# EAGLE design EnsembleThree (EAGLE 7.6.0)
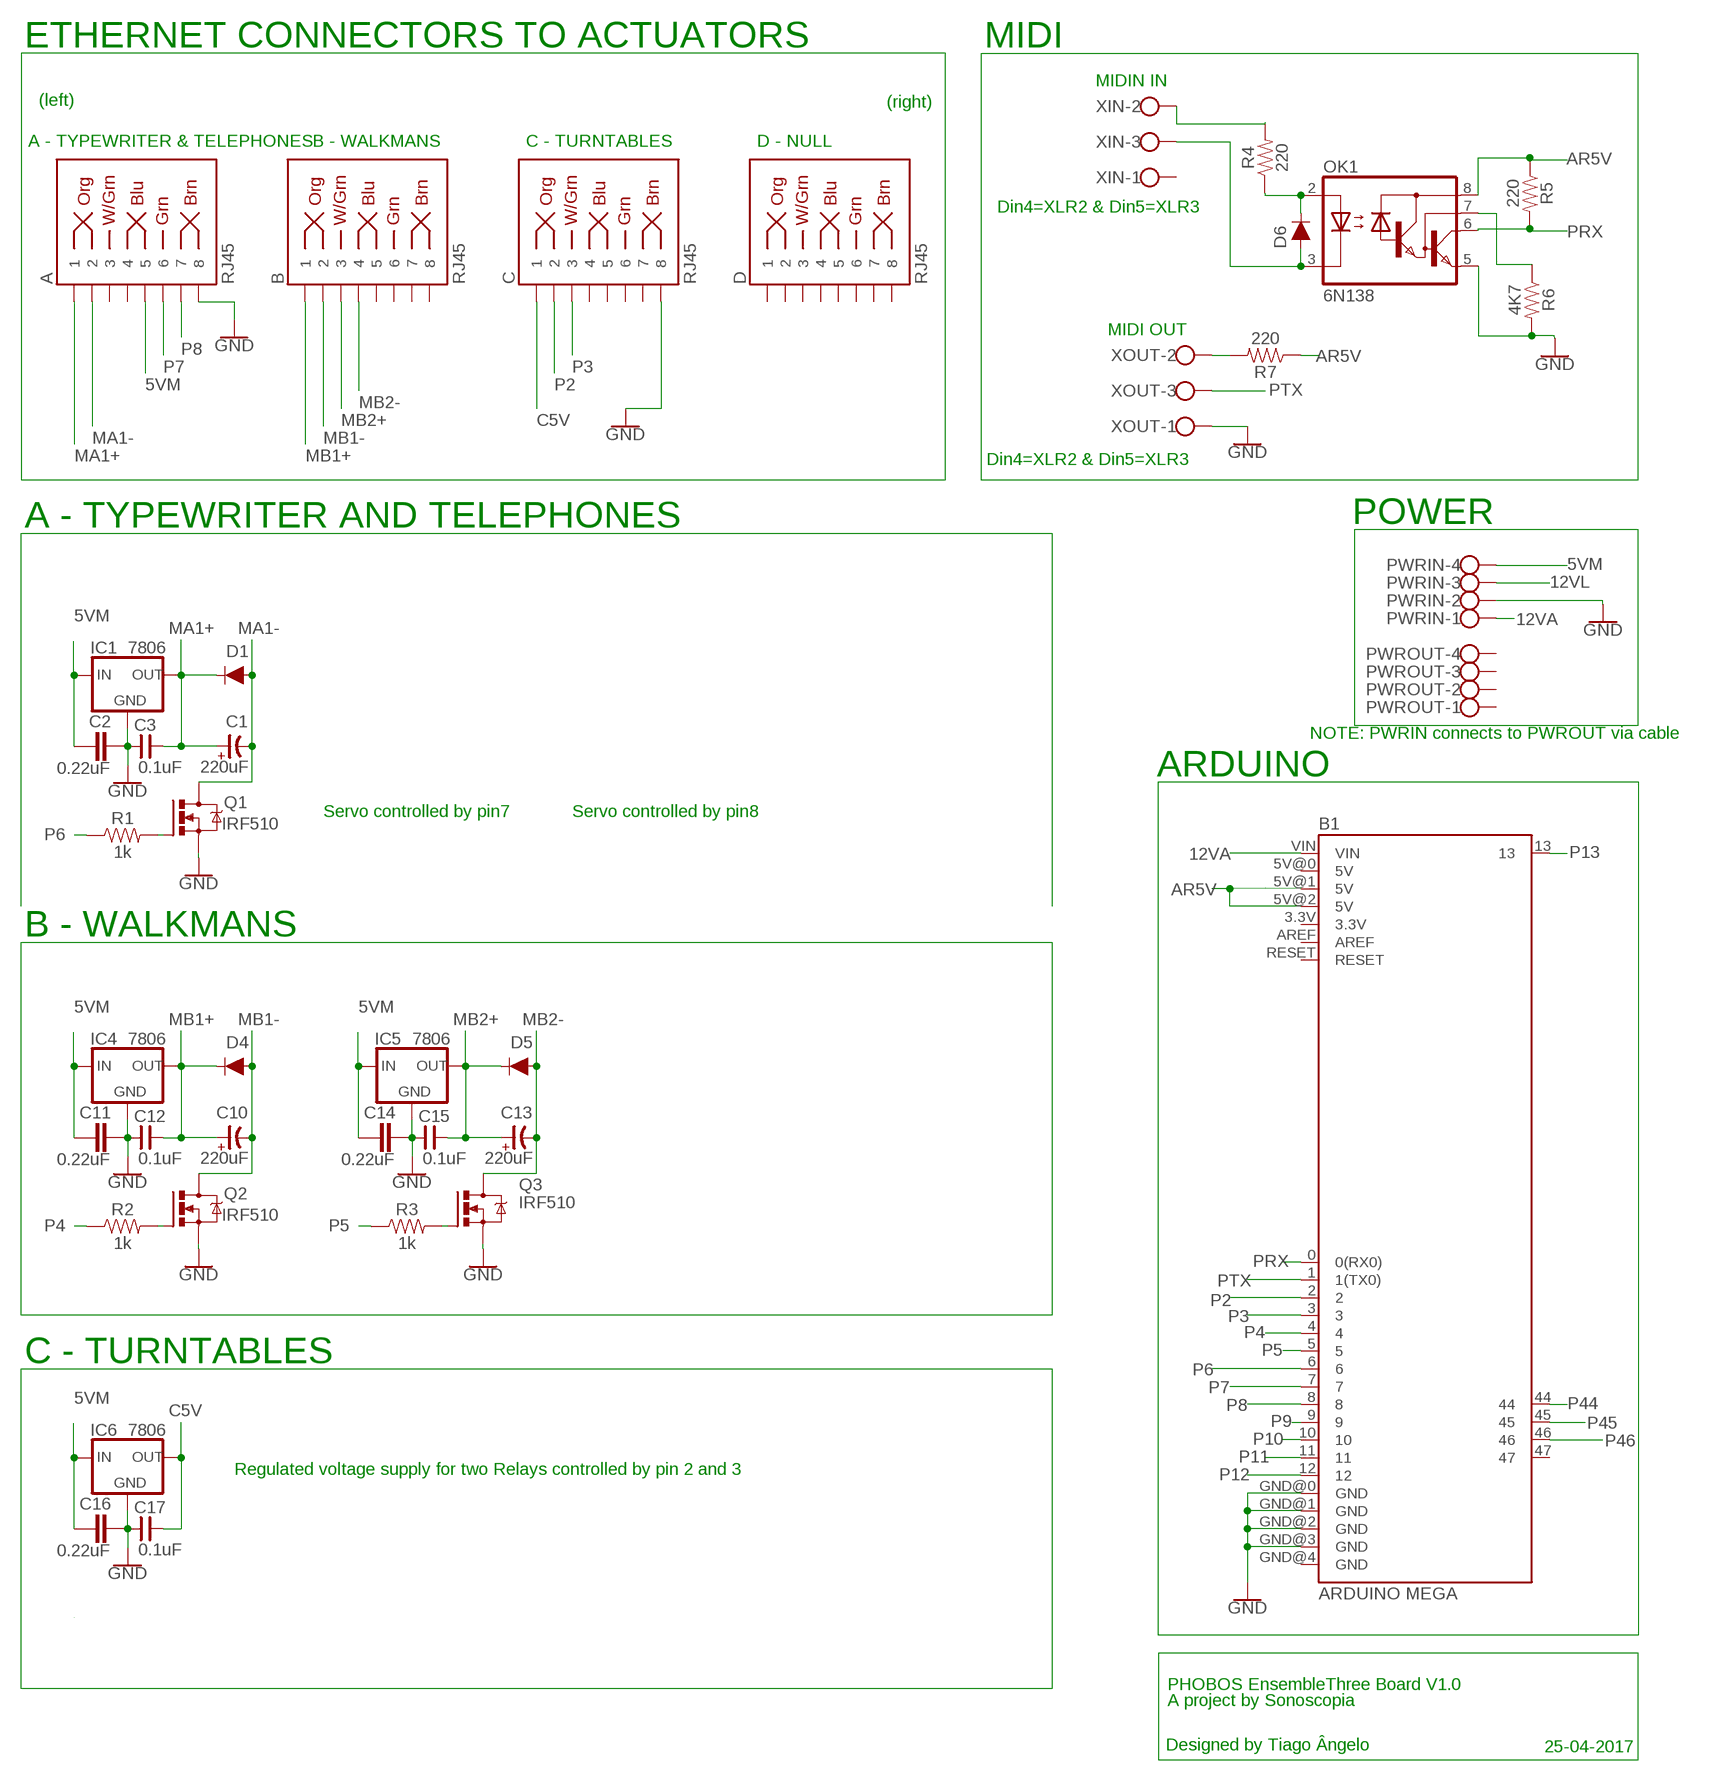
[diagram p0: schematic, sheet 1]

## Parts
A  RJ45  RJ45-8  [RJ45-8]
B  RJ45  RJ45-8  [RJ45-8]
B1  ARDUINO MEGA  ARDUINO_MEGA_R3FULL  [ARDUINO_MEGA]
C  RJ45  RJ45-8  [RJ45-8]
C1  220uF  CP-E-035X080  [E-035X080]
C2  0.22uF  C5/3  [C5B3]
C3  0.1uF  CNP-C025-050X025  [C025-050X025]
C10  220uF  CP-E-035X080  [E-035X080]
C11  0.22uF  C5/3  [C5B3]
C12  0.1uF  CNP-C025-050X025  [C025-050X025]
C13  220uF  CAP-MASTER_CP-E-035X080  [CAP-MASTER_E-035X080]
C14  0.22uF  C5/3  [C5B3]
C15  0.1uF  CNP-C025-050X025  [C025-050X025]
C16  0.22uF  C5/3  [C5B3]
C17  0.1uF  CNP-C025-050X025  [C025-050X025]
D  RJ45  RJ45-8  [RJ45-8]
D1  1A/50V/1.1V  DIODE-KIT2  [DIODE-1N4001-KIT]
D4  1A/50V/1.1V  DIODE-KIT2  [DIODE-1N4001-KIT]
D5  1A/50V/1.1V  DIODE-KIT2  [DIODE-1N4001-KIT]
D6  200mA/100V/1V  DIODE-1N4148  [DIODE-1N4148]
IC1  7806  78XXS  [78XXS]
IC4  7806  78XXS  [78XXS]
IC5  7806  78XXS  [78XXS]
IC6  7806  78XXS  [78XXS]
OK1  6N138  [DIL08]
PWRIN  W237-4  [W237-4]
PWROUT  W237-4  [W237-4]
Q1  IRF510  IRF520  [TO220BV]
Q2  IRF510  IRF520  [TO220BV]
Q3  IRF510  TRANSISTOR-POWER_IRF520  [TRANSISTOR-POWER_TO220BV]
R1  1k  1KOHM-VERT-1/4W-1%  [AXIAL-0.1]
R2  1k  1KOHM-VERT-1/4W-1%  [AXIAL-0.1]
R3  1k  1KOHM-VERT-1/4W-1%  [AXIAL-0.1]
R4  220  1KOHM-HORIZ-1/4W-5%  [AXIAL-0.3]
R5  220  1KOHM-HORIZ-1/4W-5%  [AXIAL-0.3]
R6  4K7  1KOHM-HORIZ-1/4W-5%  [AXIAL-0.3]
R7  220  1KOHM-HORIZ-1/4W-5%  [AXIAL-0.3]
XIN  W237-103  [W237-103]
XOUT  W237-103  [W237-103]

## Nets
5VM [5VM]: A.5 C2.1 C11.1 C14.1 C16.1 IC1.IN IC4.IN IC5.IN IC6.IN PWRIN.4
12VA [12VA]: B1.VIN PWRIN.1
12VL [12VL]: PWRIN.3
AR5V: B1.5V@1(5V) B1.5V@2(5V) OK1.8(VCC) R5.P$1 R7.P$1
C5V: C17.2 C.1 IC6.OUT
GND [GND]: A.8 B1.GND@0(GND) B1.GND@1(GND) B1.GND@2(GND) B1.GND@3(GND) C2.2 C3.1 C11.2 C12.1 C14.2 C15.1 C16.2 C17.1 C.8 IC1.GND IC4.GND IC5.GND IC6.GND OK1.5(GND) PWRIN.2 Q1.S Q2.S Q3.S R6.P$2 XOUT.1
MA1+: A.1 C1.+ C3.2 D1.C IC1.OUT
MA1-: A.2 C1.- D1.A Q1.D
MB1+: B.1 C10.+ C12.2 D4.C IC4.OUT
MB1-: B.2 C10.- D4.A Q2.D
MB2+: B.3 C13.+ C15.2 D5.C IC5.OUT
MB2-: B.4 C13.- D5.A Q3.D
N$1: Q1.G R1.P$2
N$2: R7.P$2 XOUT.2
N$15: Q2.G R2.P$2
N$16: Q3.G R3.P$2
N$25: D6.A OK1.3(C) XIN.3
N$26: D6.C OK1.2(A) R4.P$1
N$27: R4.P$2 XIN.2
N$29: OK1.7(VB) R6.P$1
P2: B1.2 C.2
P3: B1.3 C.3
P4: B1.4 R2.P$1
P5: B1.5 R3.P$1
P6: B1.6 R1.P$1
P7: A.6 B1.7
P8: A.7 B1.8
P9: B1.9
P10: B1.10
P11: B1.11
P12: B1.12
P13: B1.13
P44: B1.44
P45: B1.45
P46: B1.46
PRX: B1.0(0(RX0)) OK1.6(VO) R5.P$2
PTX: B1.1(1(TX0)) XOUT.3
Unconnected: A.3 A.4 B1.3.3V B1.5V@0(5V) B1.47 B1.AREF B1.GND@4(GND) B1.RESET B.5 B.6 B.7 B.8 C.4 C.5 C.6 C.7 D.1 D.2 D.3 D.4 D.5 D.6 D.7 D.8 PWROUT.1 PWROUT.2 PWROUT.3 PWROUT.4 XIN.1

## Notes on the sheet
- ETHERNET CONNECTORS TO ACTUATORS | MIDI
- MIDIN IN
- (left) | (right)
- A - TYPEWRITER & TELEPHONES | B - WALKMANS | C - TURNTABLES | D - NULL
- Din4=XLR2 & Din5=XLR3
- MIDI OUT
- Din4=XLR2 & Din5=XLR3
- A - TYPEWRITER AND TELEPHONES | POWER
- NOTE: PWRIN connects to PWROUT via cable
- ARDUINO
- Servo controlled by pin7 | Servo controlled by pin8
- B - WALKMANS
- C - TURNTABLES
- Regulated voltage supply for two Relays controlled by pin 2 and 3
- PHOBOS EnsembleThree Board V1.0
- A project by Sonoscopia
- Designed by Tiago Ângelo | 25-04-2017

## Library data of the parts
A B C D = SparkFun-Connectors:RJ45-8: RJ45 Jack - 8 pin Simple RJ45, 8-pin connection. Commonly used for Cat5, Cat5e, and Cat6 Ethernet cables. Here is the connector we sell at SparkFun: RJ45 8-Pin Connector <https://www.sparkfun.com/products/643> (PRT-00643) Datasheet <https://cdn.sparkfun.com/datasheets/Prototyping/04908.pdf> It is used on this SparkFun product: SparkFun RJ45 Breakout <https://www.sparkfun.com/products/716> (BOB-00716) Note, you may also be interested in the "MAGJACK" version of this. It is basically a RJ45 connector, but also has some status LEDs built into the connector housing. You can check that out in this library at the device named "MAGJACK.dev" and see these products online: RJ45 Ethernet MagJack-Compatible <https://www.sparkfun.com/products/8534> (PRT-08534) SparkFun RJ45 MagJack Breakout <https://www.sparkfun.com/products/13021> (BOB-13021); PROD_ID: CONN-08506; SF_ID: PRT-00643
B1 = PHOBOS-Boards:ARDUINO_MEGA_R3: Arduino Mega R3 ATmega2560 R3 compatible footprint. SparkFun Products: Arduino Mega 2560 R3 <https://www.sparkfun.com/products/11061>
C1 C10 = cap-master:CP-: POLARIZED CAP
C2 C11 C14 C16 = capacitor-wima:C: CAPACITOR naming: grid - package width
C3 C12 C15 C17 = cap-master:CNP-: NON-POLARIZED CAP
C13 = PHOBOS-lbr:CAP-MASTER_CP-: POLARIZED CAP
D1 D4 D5 = SparkFun-DiscreteSemi:DIODE: Diode These are standard reverse protection diodes and small signal diodes. SparkFun Products: SparkFun SparkPunk Sound Kit <https://www.sparkfun.com/products/11177> SparkFun ESP8266 Thing <https://www.sparkfun.com/products/13231>; PROD_ID: DIO-09176
D6 = SparkFun-DiscreteSemi:DIODE: Diode These are standard reverse protection diodes and small signal diodes. SparkFun Products: SparkFun SparkPunk Sound Kit <https://www.sparkfun.com/products/11177> SparkFun ESP8266 Thing <https://www.sparkfun.com/products/13231>; PROD_ID: DIO-08378
IC1 IC4-IC6 = v-reg:78XXS: VOLTAGE REGULATOR
OK1 = optocoupler:6N138: MOTOROLA OPTO COUPLER; MF: VISHAY/TELEFUNKEN; MPN: 6N138; OC_FARNELL: 9860150; OC_NEWARK: 35K5294
PWRIN PWROUT = con-wago-500:W237-4: WAGO SCREW CLAMP; OC_FARNELL: unknown; OC_NEWARK: unknown
Q1 Q2 = transistor-power:IRF520: HEXFET Power MOSFET
Q3 = PHOBOS-lbr:TRANSISTOR-POWER_IRF520: HEXFET Power MOSFET
R1-R3 = SparkFun-Resistors:1KOHM: 1kΩ resistor A resistor is a passive two-terminal electrical component that implements electrical resistance as a circuit element. Resistors act to reduce current flow, and, at the same time, act to lower voltage levels within circuits. - Wikipedia; PROD_ID: RES-12182
R4-R7 = SparkFun-Resistors:1KOHM: 1kΩ resistor A resistor is a passive two-terminal electrical component that implements electrical resistance as a circuit element. Resistors act to reduce current flow, and, at the same time, act to lower voltage levels within circuits. - Wikipedia; PROD_ID: RES-08380; VALUE: 1k
XIN XOUT = con-wago-500:W237-103: WAGO SCREW CLAMP; MPN: 237-103; OC_FARNELL: unknown; OC_NEWARK: 18M7116

## Net classes
0 default: width 0.508 mm, drill 0.508 mm, clearance 0.406 mm
1 GND: width 1.016 mm, drill 0.508 mm, clearance 0.508 mm
2 5VM: width 1.016 mm, drill 0.508 mm, clearance 0.508 mm
3 12VL: width 0.61 mm, drill 0.508 mm, clearance 0.508 mm
4 12VA: width 0.508 mm, drill 0.508 mm, clearance 0.508 mm
5 AR5V: width 0.406 mm, drill 0.508 mm, clearance 0.508 mm
6 PTX: width 0.406 mm, drill 0.508 mm, clearance 0.508 mm
7 PRX: width 0.406 mm, drill 0.508 mm, clearance 0.508 mm

## Board
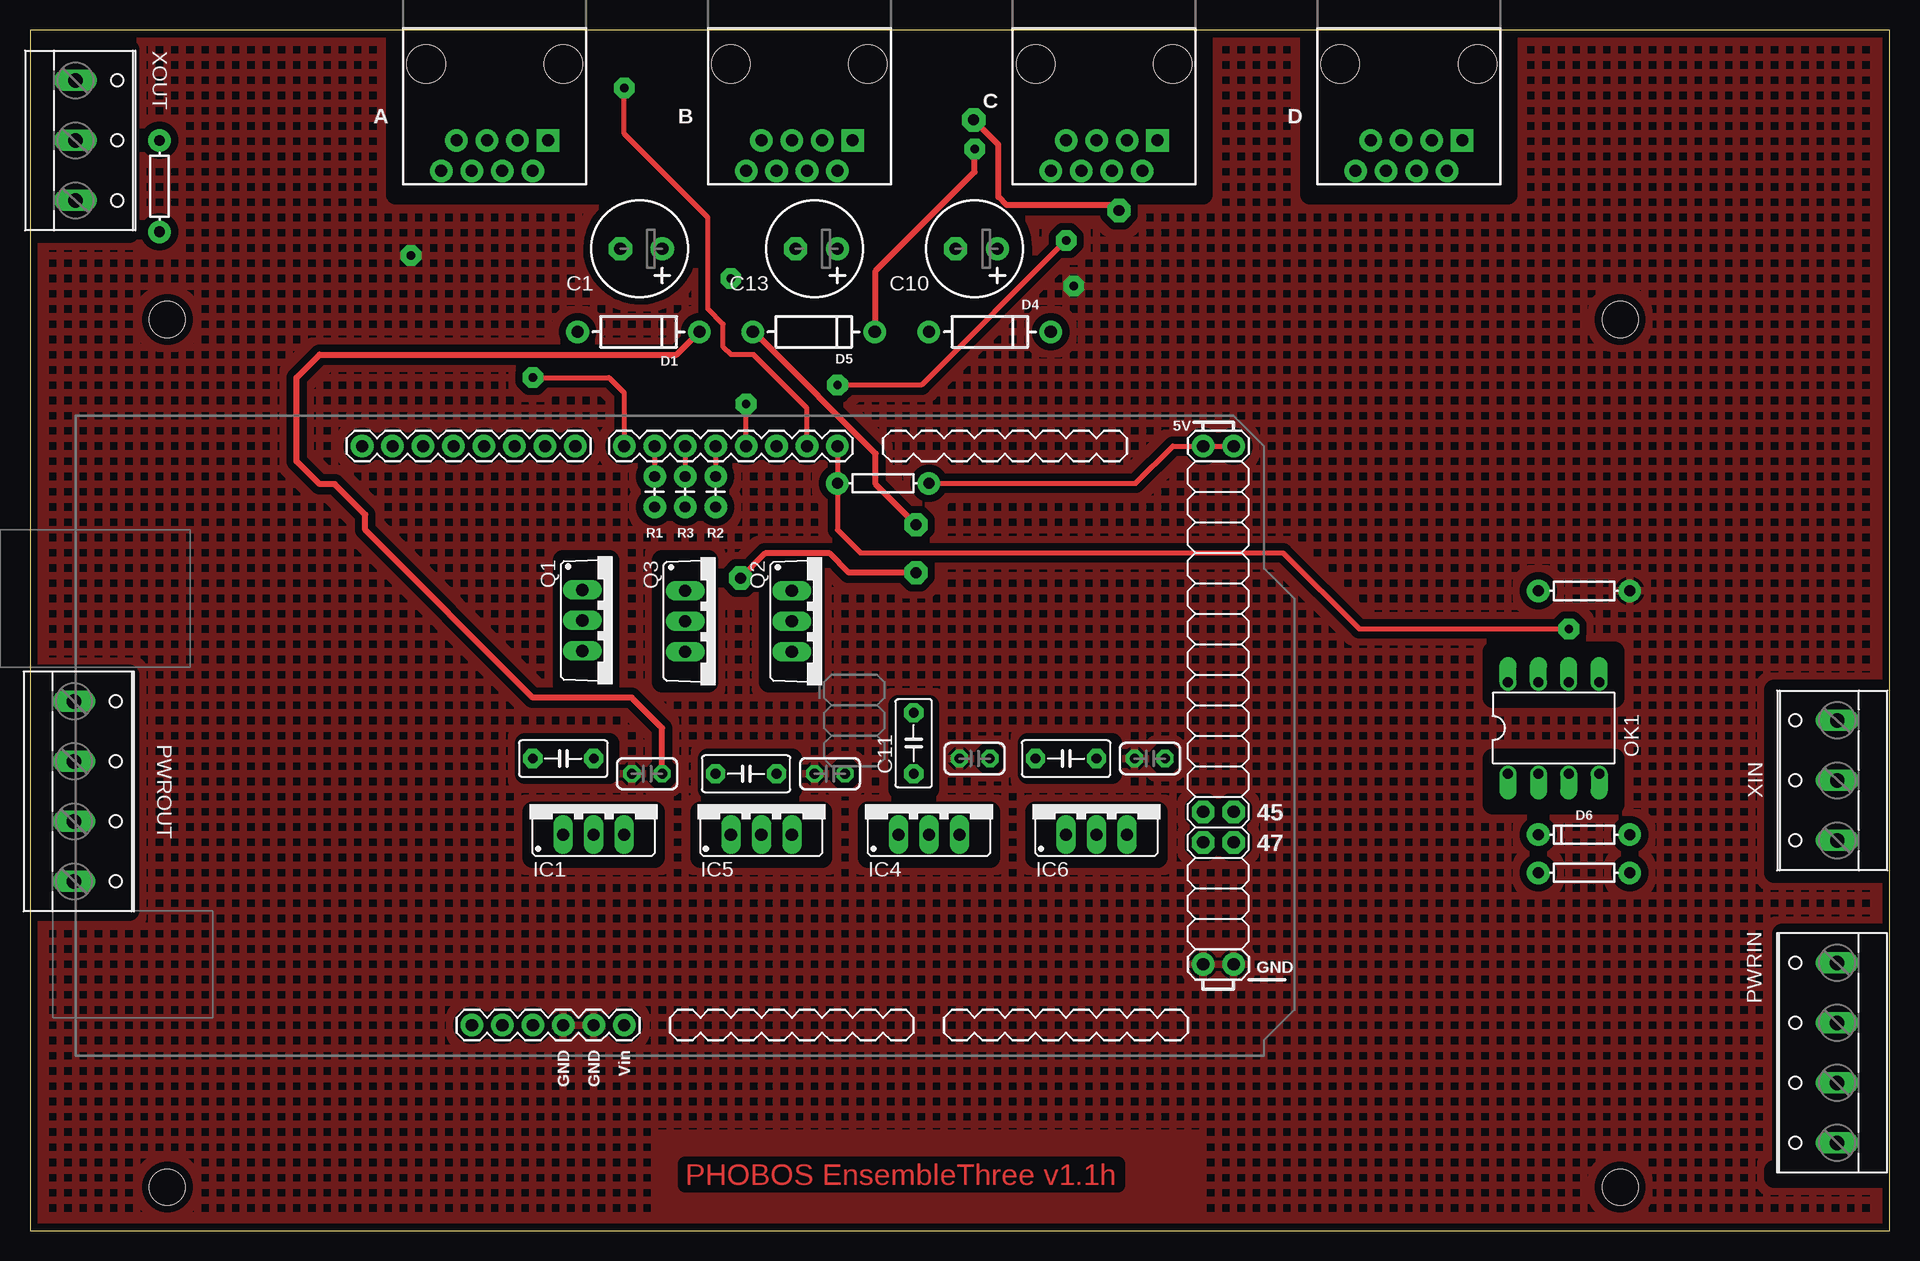
[diagram p1: board, top side]
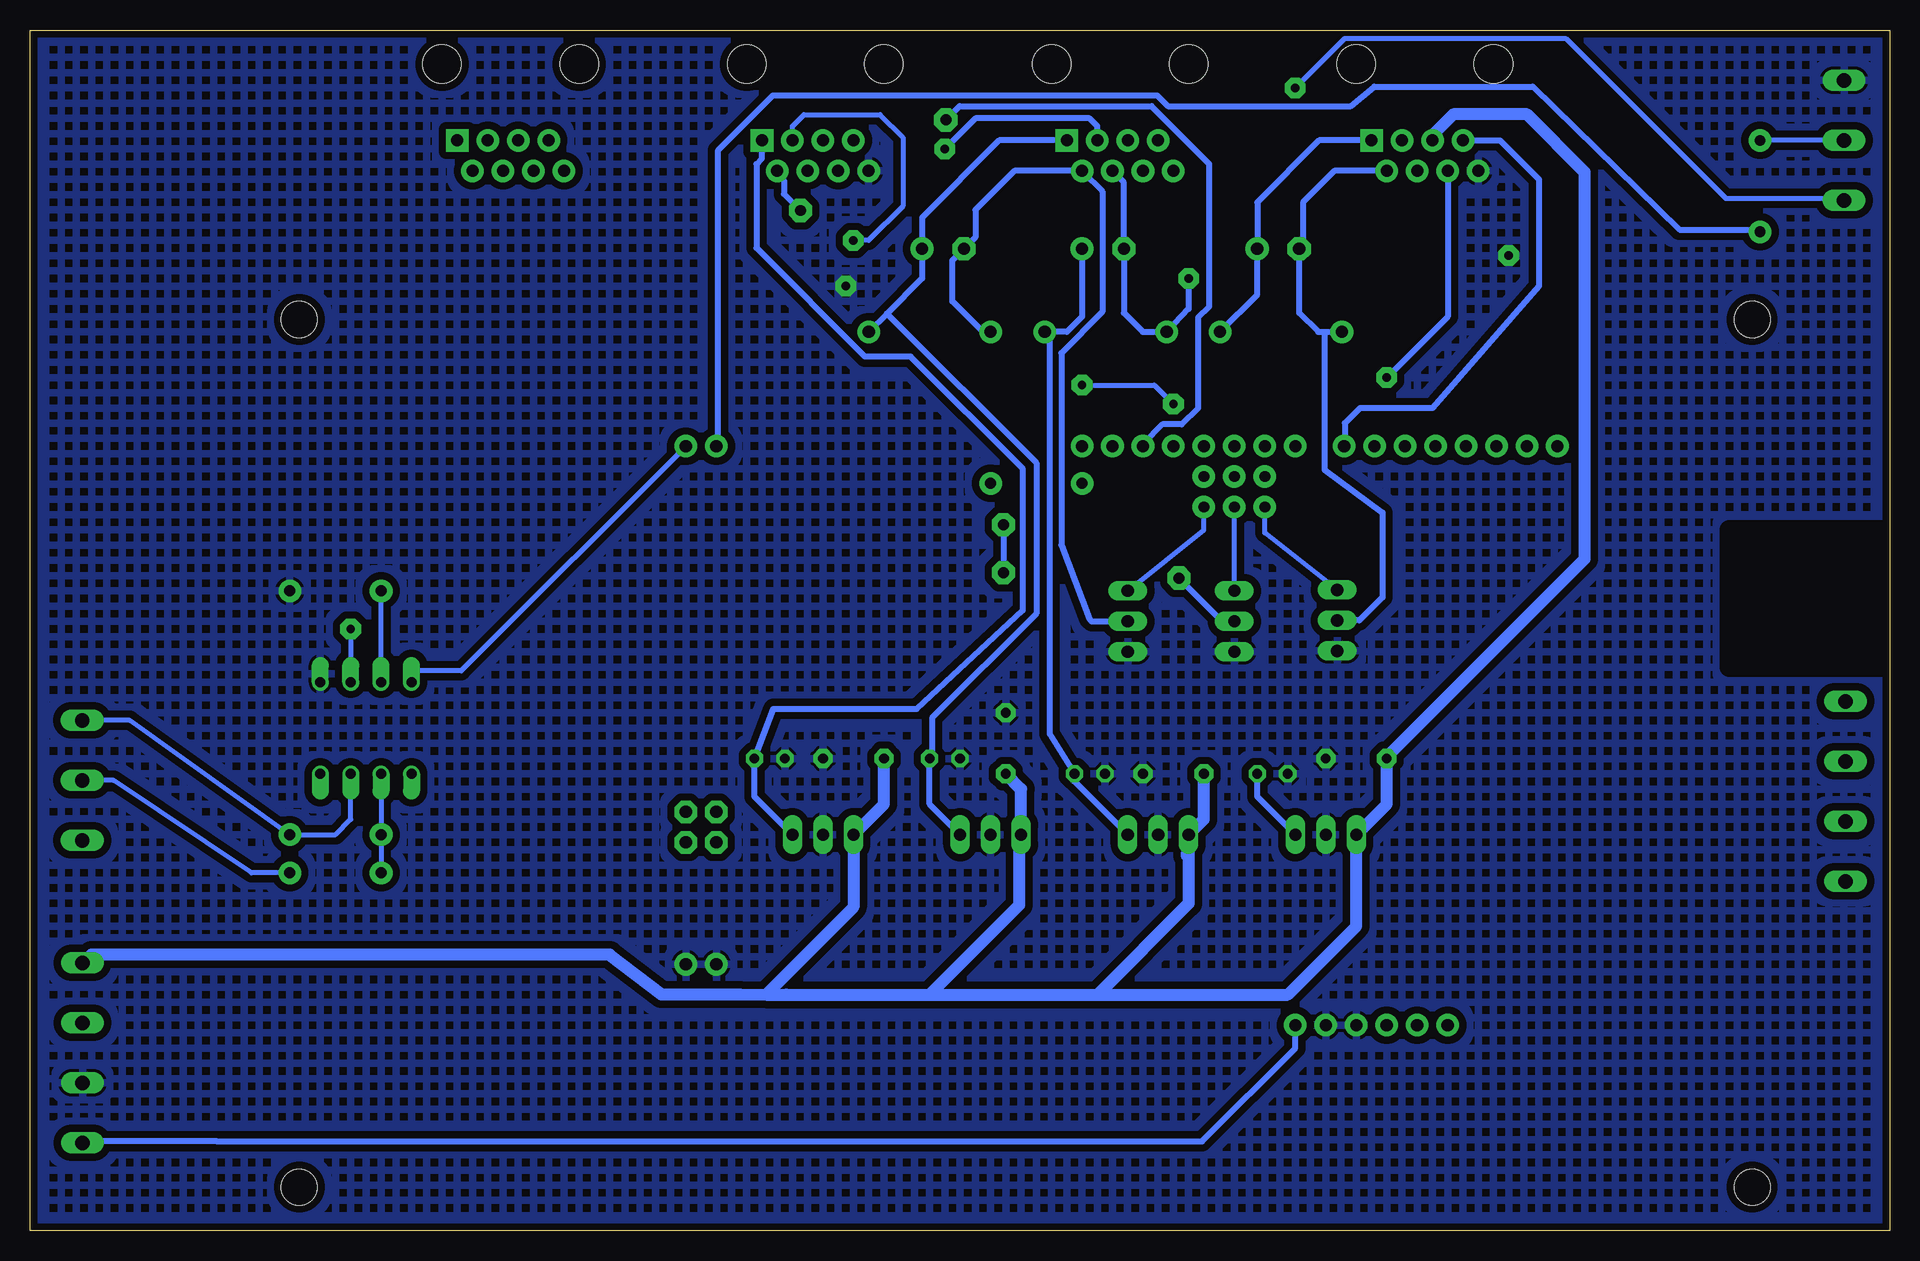
[diagram p2: board, bottom side, seen from below]

Size 155 x 100.08 mm. Coordinates in mm from the lower left corner, seen from the top.
Outline: 0,0 155,0 155,100.08 0,100.08 0,0
Copper layers (1*16): Top 0.035mm / dielectric 1.5mm / Bottom 0.035mm
Design rules "Dek": minimum track width 12mil, minimum drill 36mil, track to track 12mil, track to pad 12mil, pad to pad 12mil, via to via 12mil, smd to smd 0mil, copper to edge 10mil, drill to drill 12mil, minimum pad ring 12mil, minimum via ring 20mil, stop-mask expansion 4mil, vias tented up to drill 25mil, thermal gap 10mil
Holes 3 mm at 132.55,75.95 132.55,3.65 11.45,3.65 11.45,75.95
tRestrict: area 30.5,86.4 to 47,108; area 55.9,86.4 to 72.4,108; area 81.3,86.4 to 97.8,108; area 106.7,86.4 to 123.2,108; area -0.6,26.7 to 8.3,46.4; area 145.4,4.4 to 154.9,24.8; area 145.4,29.8 to 154.3,45.1; area -0.6,83.2 to 8.3,98.4; area 121.9,44.5 to 132.1,48.3; area 121.9,35.6 to 132.1,39.4; area 47,78 to 54.7,85.8; area 61.6,78 to 69.3,85.8; 12 more areas
bRestrict: area -2.5,47 to 13.3,58.4
vRestrict: area 71.1,64.1 to 91.4,66.7; area 96.5,36.2 to 101.6,64.1; area 96.5,23.5 to 101.6,31.1; area 53.3,15.9 to 73.7,18.4; area 76.2,15.9 to 96.5,18.4; area -2.5,47 to 13.3,58.4; area 26,64.1 to 47,66.7; area 121.9,38.7 to 132.1,44.5; area 18.4,71.8 to 24.8,74.3; area 32.4,71.8 to 38.7,74.3; area 47.6,73.7 to 54,76.2; area 62.2,73.7 to 68.6,76.2; 1 more areas

### Footprints (pad centres in the part's own frame; a part is rotated, then mirrored left to right if it is on the bottom)
RJ45-8 = drill 1 pad 1.88 square: 1 -4.445,6.35 | drill 1 pad 1.88: 2 -3.175,8.89; 3 -1.905,6.35; 4 -0.635,8.89; 5 0.635,6.35; 6 1.905,8.89; 7 3.175,6.35; 8 4.445,8.89 | hole 3.2: -5.715,0; 5.715,0
ARDUINO_MEGA = drill 1.016 pad 1.88: 0 13.97,24.13; 1 11.43,24.13; 2 8.89,24.13; 3 6.35,24.13; 3.3V -13.97,-24.13; 4 3.81,24.13; 5 1.27,24.13; 5V@0 -11.43,-24.13; 5V@1 44.45,24.13; 5V@2 46.99,24.13; 6 -1.27,24.13; 7 -3.81,24.13; 8 -7.874,24.13; 9 -10.414,24.13; 10 -12.954,24.13; 11 -15.494,24.13; 12 -18.034,24.13; 13 -20.574,24.13; AREF -25.654,24.13; GND@0 -8.89,-24.13; GND@1 -6.35,-24.13; GND@2 44.45,-19.05; GND@3 46.99,-19.05; GND@4 -23.114,24.13; RESET -16.51,-24.13; VIN -3.81,-24.13 | drill 1.016 pad 1.88 octagon: 44 44.45,-6.35; 45 46.99,-6.35; 46 44.45,-8.89; 47 46.99,-8.89
E-035X080 = drill 1.016 pad 1.93: + -1.905,0 | drill 1.016 pad 1.93 octagon: - 1.587,0
C5B3 = drill 0.813 pad 1.6 octagon: 1 -2.54,0; 2 2.54,0
C025-050X025 = drill 0.813 pad 1.422 octagon: 1 -1.27,0; 2 1.27,0
CAP-MASTER_E-035X080 = drill 1.016 pad 1.93: + -1.905,0 | drill 1.016 pad 1.93 octagon: - 1.587,0
DIODE-1N4001-KIT = drill 1.016 pad 1.88: A -5.08,0; C 5.08,0
DIODE-1N4148 = drill 0.9 pad 1.88: A -3.81,0; C 3.81,0
78XXS = drill 1.016 long: GND 0,-2.54; IN -2.54,-2.54; OUT 2.54,-2.54
DIL08 = drill 0.813 offset: 1 -3.81,-3.81; 2 -1.27,-3.81; 3 1.27,-3.81; 4 3.81,-3.81; 5 3.81,3.81; 6 1.27,3.81; 7 -1.27,3.81; 8 -3.81,3.81
W237-4 = drill 1.194 long: 1 -7.5,-1.27; 2 -2.5,-1.27; 3 2.5,-1.27; 4 7.5,-1.27
TO220BV = drill 1.016 long: D 0,-2.54; G -2.54,-2.54; S 2.54,-2.54
TRANSISTOR-POWER_TO220BV = drill 1.016 long: D 0,-2.54; G -2.54,-2.54; S 2.54,-2.54
AXIAL-0.1 = drill 0.9 pad 1.88: P$1 -1.27,0; P$2 1.27,0
AXIAL-0.3 = drill 0.9 pad 1.88: P$1 -3.81,0; P$2 3.81,0
W237-103 = drill 1.194 long: 1 -5,-1.29; 2 0,-1.29; 3 5,-1.29

### Placement (x,y rotation side)
A  38.73,97.23 180 top
B  64.13,97.23 180 top
B1  53.34,41.27 0 top
C  89.53,97.23 180 top
C1  50.8,81.84 180 top
C2  44.45,39.37 0 top
C3  51.43,38.1 0 top
C10  78.74,81.84 180 top
C11  73.66,40.64 90 top
C12  78.74,39.37 0 top
C13  65.41,81.84 180 top
C14  59.69,38.1 0 top
C15  66.68,38.1 0 top
C16  86.36,39.37 0 top
C17  93.34,39.37 0 top
D  114.94,97.23 180 top
D1  50.73,74.93 0 top
D4  80.01,74.93 0 top
D5  65.33,74.93 0 top
D6  129.54,33.02 180 top
IC1  46.99,35.56 0 top
IC4  74.93,35.56 0 top
IC5  60.96,35.56 0 top
IC6  88.9,35.56 0 top
OK1  127,41.91 0 top
PWRIN  149.35,14.84 90 top
PWROUT  4.93,36.63 270 top
Q1  48.58,50.88 270 top
Q2  66.04,50.8 270 top
Q3  57.15,50.8 270 top
R1  52.07,61.59 270 top
R2  57.15,61.59 270 top
R3  54.61,61.59 270 top
R4  129.54,29.84 0 top
R5  71.12,62.3 180 top
R6  129.54,53.34 0 top
R7  10.79,87.07 90 top
XIN  149.35,37.54 90 top
XOUT  5.08,90.88 270 top

### Tracks (layer width: path | path; a pad name or v marks a point on that pad's centre or on a via)
5VM
  Bottom 1.016: 58.58,31.27 IC5.IN | PWRIN.4 150.5,22.38 149.86,23.02 106.68,23.02 102.37,19.71 95.78,19.71 93.66,19.7 | IC5.IN 57.15,34.29 C14.1 | 93.66,19.7 91.95,19.68 80.01,19.68 | 80.01,19.68 66.04,19.68 | 66.04,19.68 50.16,19.68 44.45,25.4 IC1.IN 41.91,35.56 C2.1 41.63,39.78 25.4,56.01 25.4,88.24 30.2,93.04 36.37,93.04 37.97,91.44 37.97,90.98 A.5 | IC5.IN 58.42,27.3 66.04,19.68 | 80.01,19.68 72.55,27.15 72.55,32.54 IC4.IN 72.39,36.83 C11.1 | 93.66,19.7 86.36,27 IC6.IN 83.82,35.56 C16.1
12VA
  Bottom 0.508: PWRIN.1 150.5,7.46 139.41,7.47 57.3,7.47 49.53,15.24 B1.VIN
AR5V
  Top 0.406: B1.5V@2 B1.5V@1 95.25,65.41 92.15,62.3 R5.P$1
  Bottom 0.406: 122.99,46.56 122.99,45.87 OK1.8 122.87,46.67 119.06,46.67 B1.5V@2
  Bottom 0.508: R7.P$1 11,83.44 17.5,83.44 29.74,95.36 42.95,95.36 44.91,93.73 60.15,93.73 61.06,94.64 93.07,94.64 97.64,90.07 97.64,65.61 B1.5V@1
C5V
  Bottom 0.508: C.1 93.98,89.38 94.46,88.9 94.46,81.92 85.41,72.87 81.6,72.87 72.23,63.5 72.24,63.49 72.24,51.71 81.06,43.5 93.03,43.5 C17.2 94.62,36.2 IC6.OUT
GND  (via drill 0.7)
  other vias: 31.75,81.28 87,78.74
  pour Bottom (isolate 0.61, hatched): -5.08,104.14 160.02,104.14 160.02,0 -5.08,0
  pour Top (isolate 0.61, hatched): 0,100.33 154.94,100.33 154.94,0 0,0
MA1+
  Top 0.508: C3.2 52.71,41.91 50.16,44.45 41.91,44.45 27.94,58.42 27.94,59.69 25.4,62.23 24.13,62.23 22.23,64.14 22.23,71.12 24.13,73.03 53.9,73.03 D1.C
  Bottom 0.508: A.1 47.55,90.88 52.71,85.72 C1.+ 52.71,78.03 D1.C | IC1.OUT 52.71,36.2 C3.2
MA1-
  Bottom 0.508: A.2 46.28,88.34 48.9,85.72 48.9,82.16 C1.- 49.21,76.52 47.62,74.93 47.09,74.93 | 47.09,74.93 D1.A | 47.09,74.93 47.09,63.42 42.27,59.87 42.27,52.81 44.2,50.88 Q1.D
MB1+
  Bottom 0.508: B.1 74.22,90.88 80.65,84.45 C10.+ 80.65,79.38 83.57,76.45 | 83.57,76.45 D4.C | IC4.OUT 80.01,35.56 C12.2 79.81,39.55 79.81,42.75 71.12,51.44 71.12,64.01 83.57,76.45
MB1-
  Bottom 0.508: D4.A 75.56,74.93 78.1,77.47 78.1,80.89 C10.- 76.2,82.79 76.2,85.09 72.95,88.34 B.2 67.21,88.24 65.61,86.64 65.61,76.58 69.04,73.15 69.04,57.15 66.68,50.98 66.5,50.8 Q2.D
MB2+  (via drill 0.7)
  Top 0.508: v78.74,90.17 78.74,88.27 70.49,80.01 70.49,74.93 D5.C
  Bottom 0.508: C13.+ 67.31,76.2 68.58,74.93 D5.C 70.01,74.77 70.01,41.43 C15.2 67.94,37.47 IC5.OUT | B.3 66.04,92.08 66.68,92.71 76.2,92.71 v78.74,90.17
MB2-  (via drill 0.7, 0.91)
  Top 0.508: v59.23,54.41 61.29,56.46 66.65,56.46 68.25,54.86 v73.86,54.86 | 60.38,74.75 D5.A 60.96,74.3 70.49,64.77 70.49,62.23 v73.86,58.85
  Bottom 0.508: B.4 63.82,87.39 C13.- 63.82,76.52 62.23,74.93 D5.A 58.42,76.83 v58.42,79.38 | v59.23,54.41 55.8,50.98 54.66,50.98 Q3.D | v73.86,58.85 v73.86,54.86
N$1
  Bottom 0.406: Q1.G 52.07,58.18 R1.P$2
N$2
  Bottom 0.406: XOUT.2 R7.P$2
N$3
  pour Top (isolate 0.813): 52.07,8.26 97.79,8.26 97.79,1.27 52.07,1.27
N$15
  Bottom 0.406: Q2.G 57.15,58.42 R2.P$2
N$16
  Bottom 0.406: Q3.G R3.P$2
N$25
  Bottom 0.406: OK1.3 128.27,34.29 129.54,33.02 D6.A 146.68,42.54 XIN.3
N$26
  Bottom 0.406: OK1.2 D6.C R4.P$1
N$27
  Bottom 0.406: R4.P$2 136.53,29.84 148.03,37.54 XIN.2
N$29
  Bottom 0.406: OK1.7 R6.P$1
P2  (via drill 0.91)
  Top 0.508: v78.66,92.58 80.72,90.53 80.72,86.18 81.41,85.5 90.32,85.5 v90.78,85.04
  Bottom 0.508: v78.66,92.58 77.52,93.73 61.52,93.73 56.72,88.92 56.72,77.04 57.63,76.12 57.63,68.58 59,67.21 60.6,67.21 62.21,65.61 B1.2 | v90.78,85.04 92.15,86.41 92.15,87.55 92.84,88.24 C.2
P3  (via drill 0.7)
  Top 0.406: B1.3 v59.69,68.9 | v67.31,70.48 74.29,70.48 v86.36,82.55
  Bottom 0.406: C.3 91.44,92.08 90.49,93.03 84.14,93.03 82.23,91.12 82.23,85.41 85.09,82.55 v86.36,82.55 | v59.69,68.9 61.28,70.48 v67.31,70.48
P4
  Top 0.406: B1.4 R2.P$1
P5
  Top 0.406: B1.5 R3.P$1
P6
  Top 0.406: B1.6 R1.P$1
P7  (via drill 0.7)
  Top 0.406: v41.91,71.12 48.26,71.12 49.53,69.85 B1.7
  Bottom 0.508: A.6 36.83,76.2 v41.91,71.12
P8
  Bottom 0.508: A.7 32.46,90.88 29.21,87.63 29.21,78.74 38.1,68.58 44.13,68.58 45.4,67.31 45.4,66.1 B1.8
PRX  (via drill 0.7)
  Top 0.406: B1.0 R5.P$2 67.31,58.42 69.22,56.52 104.46,56.52 110.81,50.16 v128.27,50.16
  Bottom 0.406: v128.27,50.16 OK1.6
PTX  (via drill 0.7)
  Top 0.406: B1.1 64.77,68.58 60.32,73.03 58.42,73.03 57.79,73.66 57.79,75.56 56.51,76.83 56.51,84.45 49.53,91.44 v49.53,95.25
  Bottom 0.406: v49.53,95.25 45.4,99.38 26.99,99.38 13.65,86.04 3.81,86.04 XOUT.3

### Text on the board
Top: PHOBOS EnsembleThree v1.1h
tSilk: WALKMANS | TABLES | TELEPHONES | TURN | TYPEWRITER | NULL